# EAGLE design LED_Keychain_rev2 (EAGLE 9.6.2)
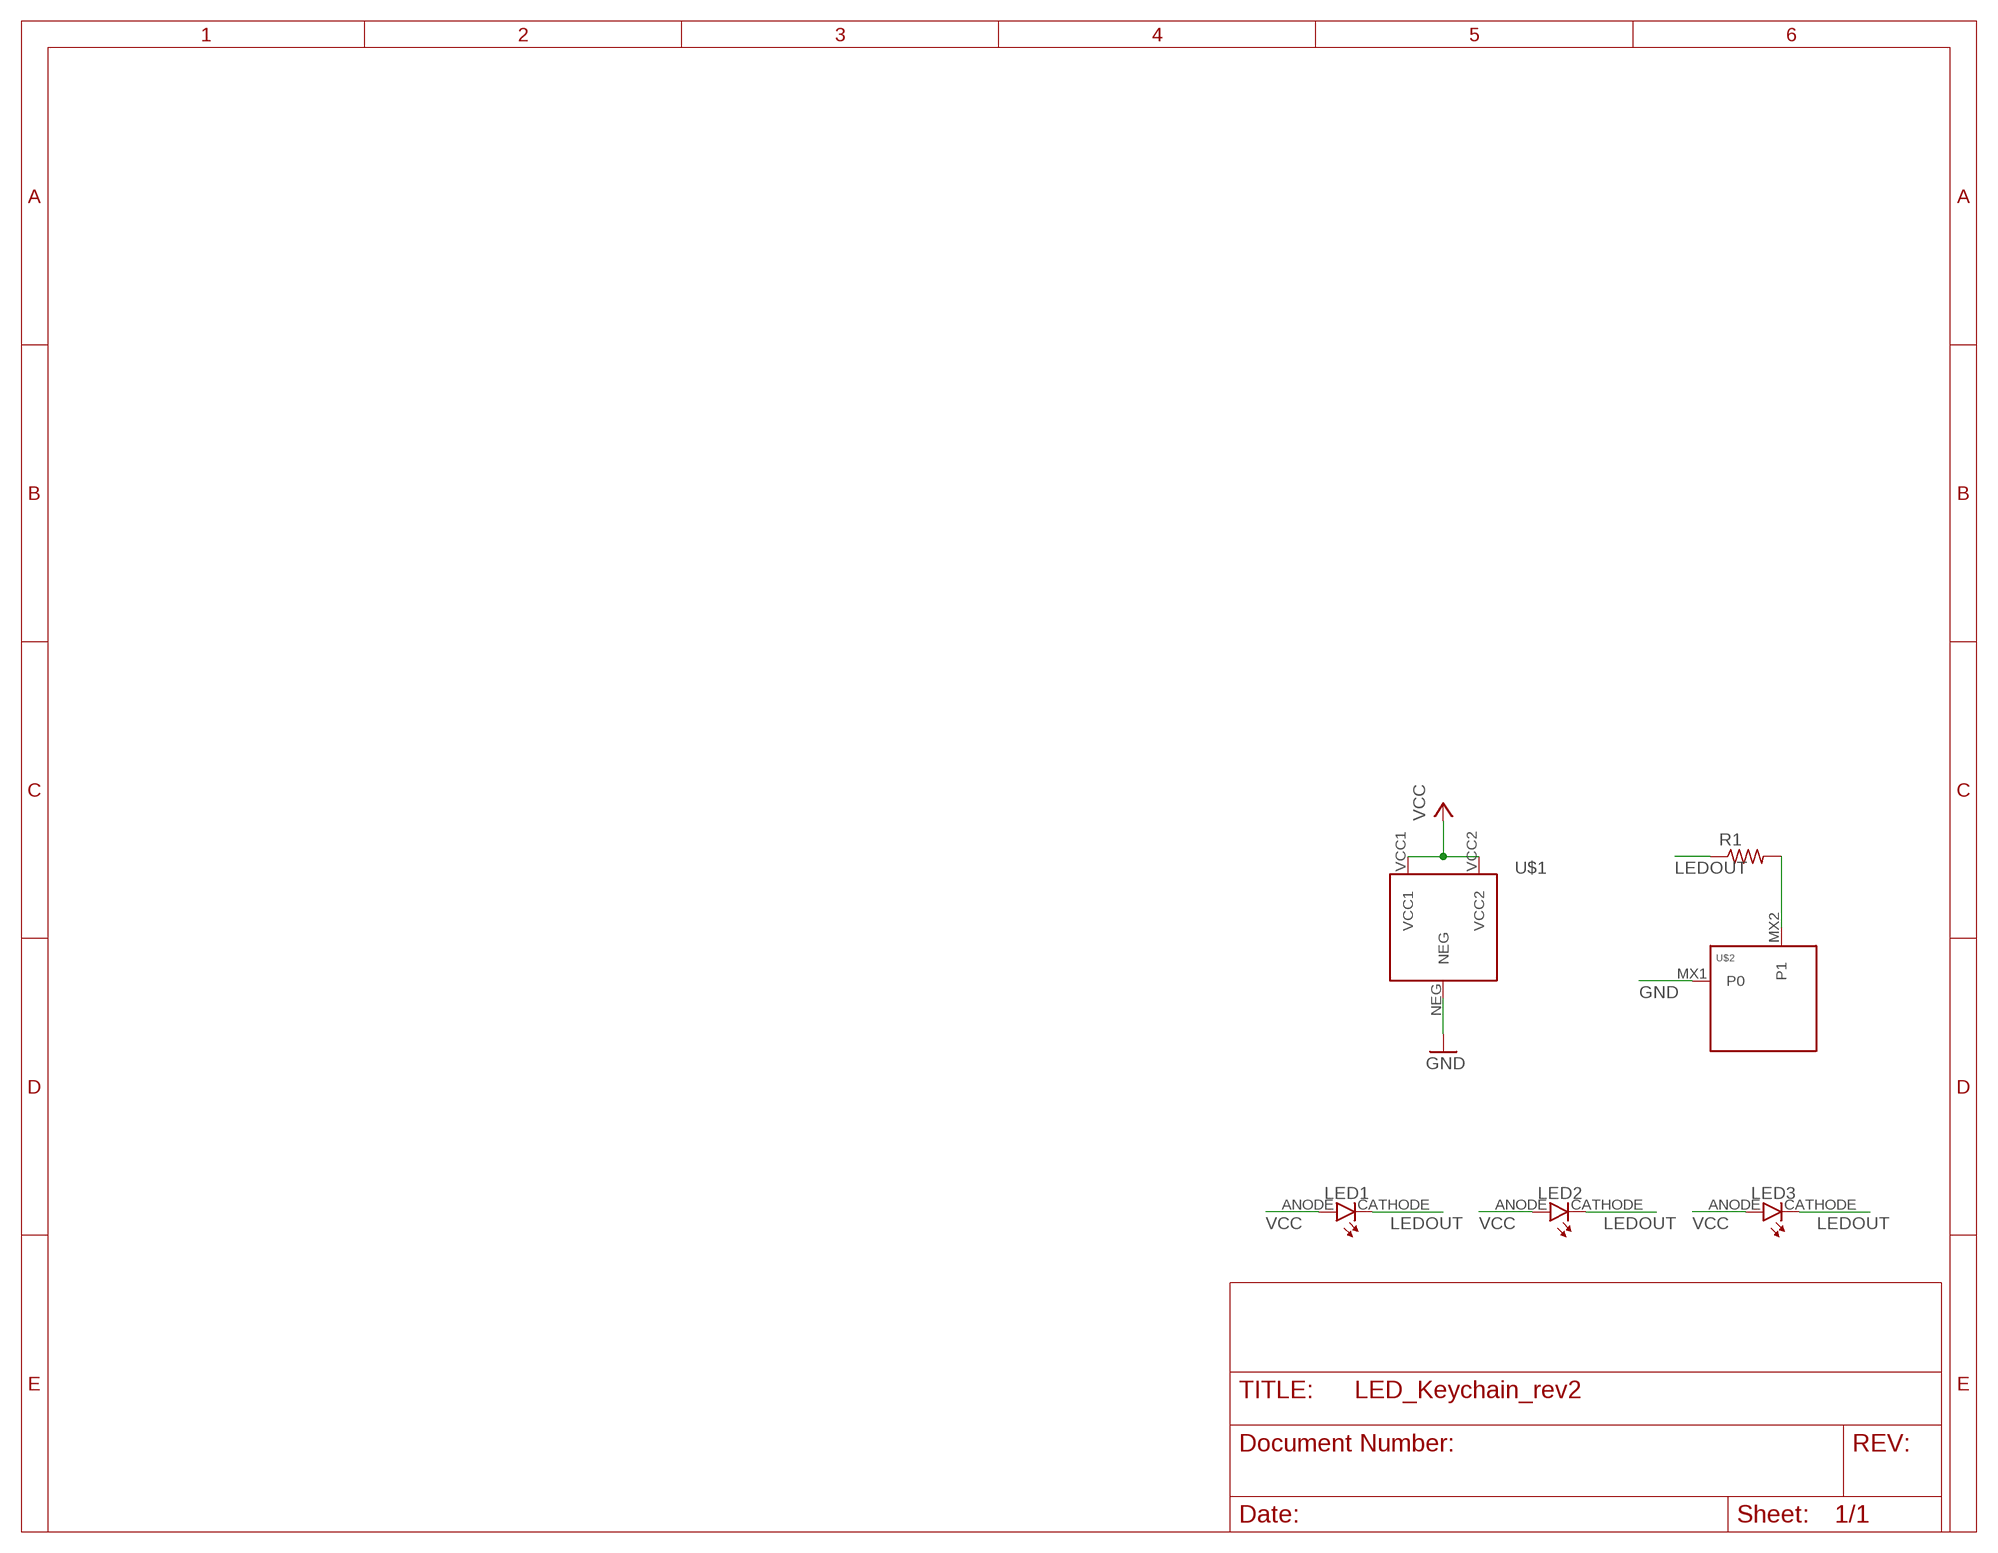
[diagram p0: schematic, sheet 1]

## Parts
LED1  KINGBRIGHT-A1608  [KINGBRIGHT-0603]
LED2  KINGBRIGHT-A1608  [KINGBRIGHT-0603]
LED3  KINGBRIGHT-A1608  [KINGBRIGHT-0603]
R1  R-US_R0603  [R0603]
U$1  KEYSTONE3035  [KEYSTONE3035]
U$2  KEYSWITCH-PLAIN-MX-1U  [MX-1U]

## Nets
GND: U$1.NEG U$2.MX1(P0)
LEDOUT: LED1.CATHODE LED2.CATHODE LED3.CATHODE R1.1
N$4: R1.2 U$2.MX2(P1)
VCC: LED1.ANODE LED2.ANODE LED3.ANODE U$1.VCC1 U$1.VCC2

## Library data of the parts
LED1-LED3 = LED_Keychain_lib:KINGBRIGHT-A1608
R1 = adafruit:R-US_: RESISTOR, American symbol
U$1 = LED_Keychain_lib:KEYSTONE3035
U$2 = Keyboard:KEYSWITCH-PLAIN

## Board
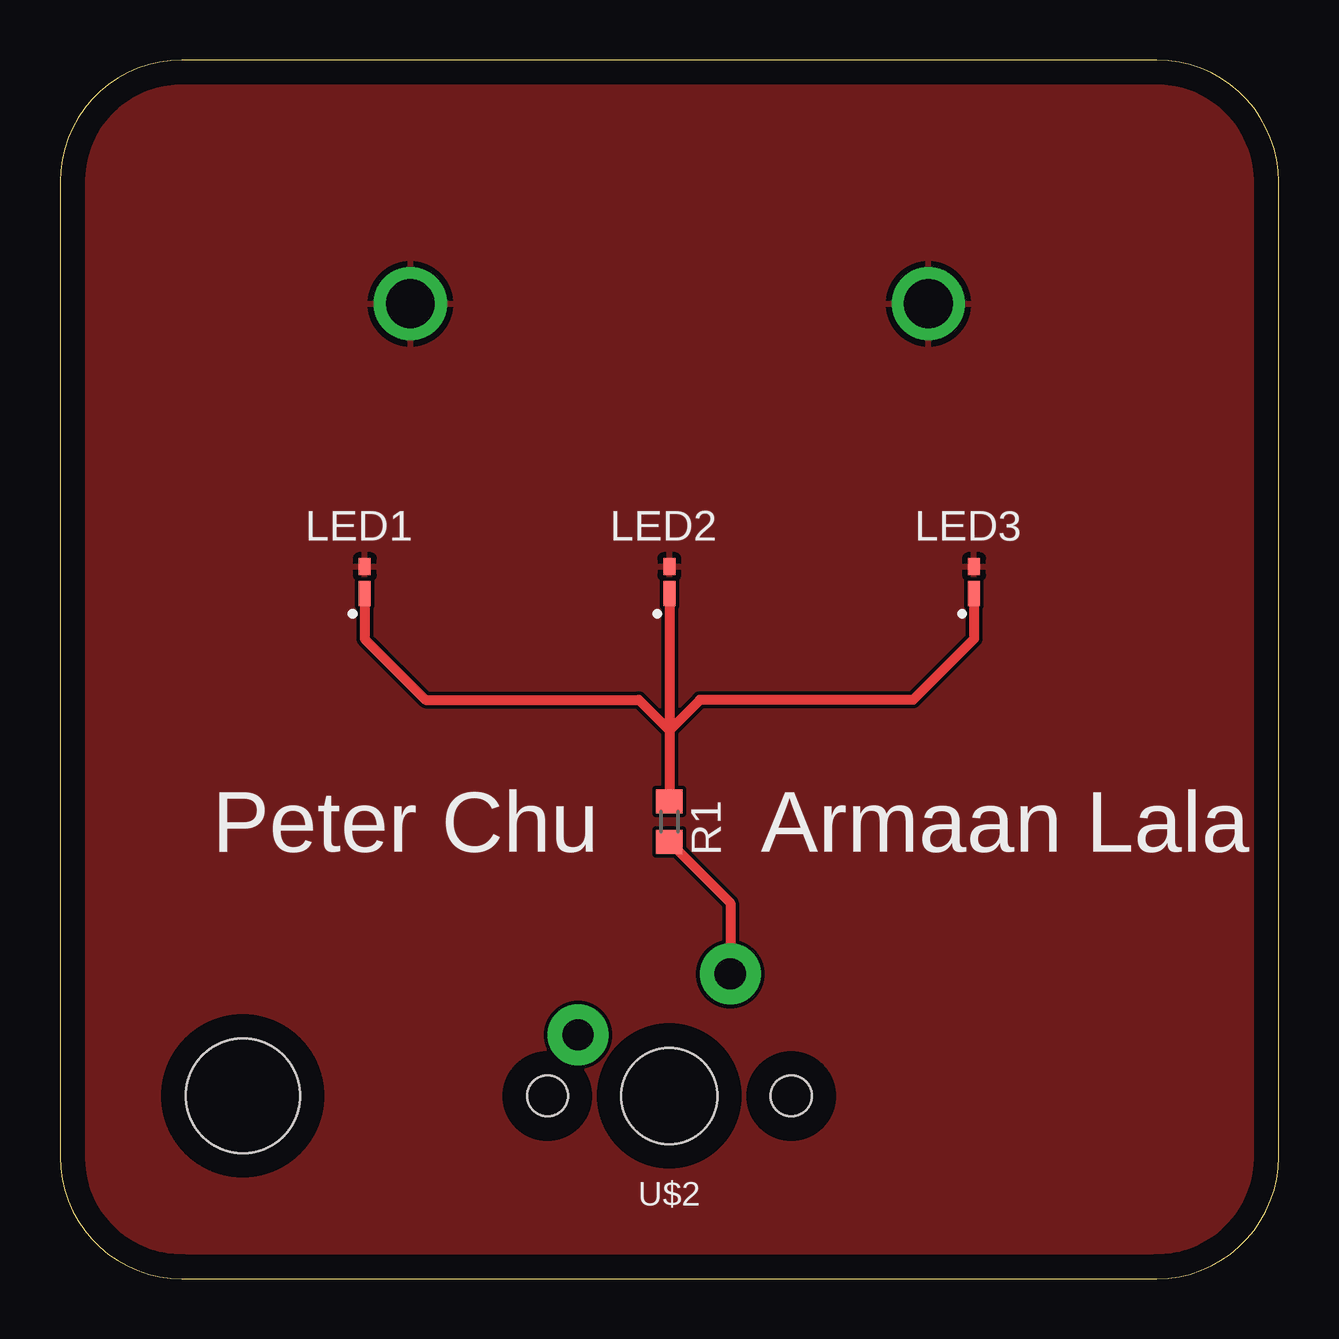
[diagram p1: board, top side]
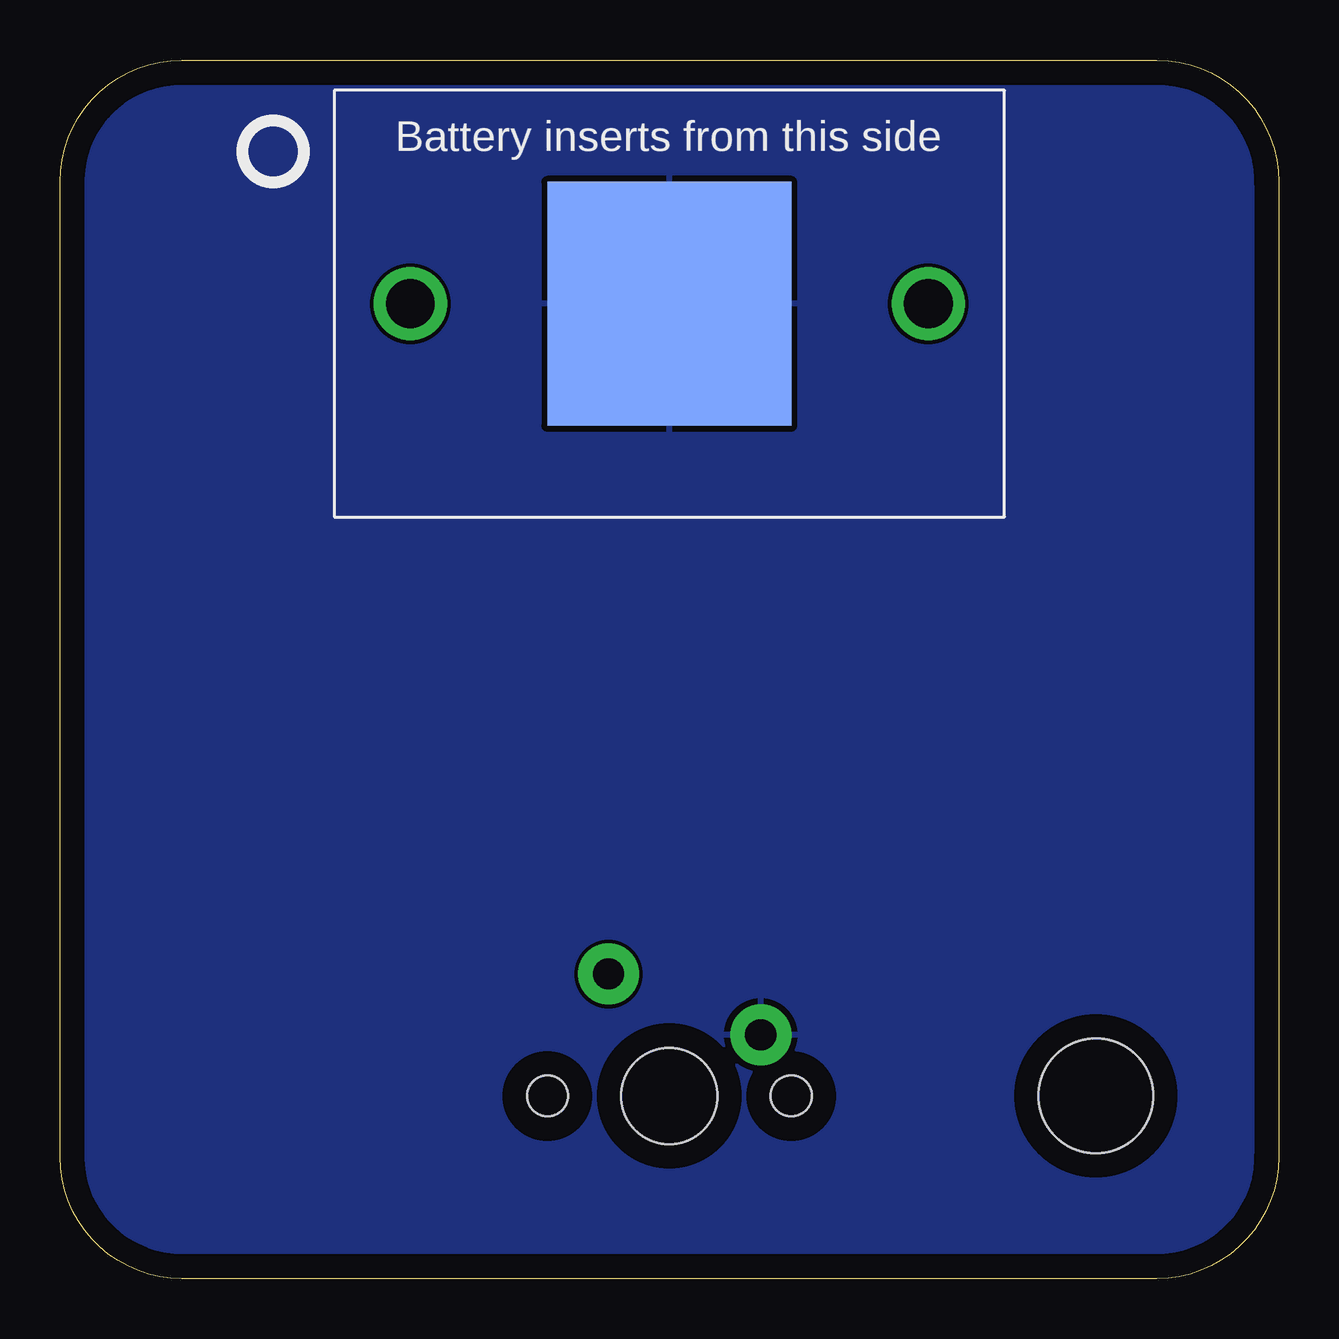
[diagram p2: board, bottom side, seen from below]

Size 50.8 x 50.8 mm. Coordinates in mm from the lower left corner, seen from the top.
Outline: 45.72,50.8 5.08,50.8 arc90 0,45.72 0,5.08 arc90 5.08,0 45.72,0 arc90 50.8,5.08 50.8,45.72 arc90 45.72,50.8
Copper layers (1*16): Top 0.035mm / dielectric 1.5mm / Bottom 0.035mm
Design rules "default": minimum track width 6mil, minimum drill 0.35mm, track to track 6mil, track to pad 6mil, pad to pad 6mil, via to via 6mil, smd to smd 6mil, copper to edge 40mil, drill to drill 6mil, minimum pad ring 10mil, minimum via ring 8mil, stop-mask expansion 4mil, vias tented up to drill 0mil, thermal gap 10mil
Holes 4.76 mm at 7.62,7.62

### Footprints (pad centres in the part's own frame; a part is rotated, then mirrored left to right if it is on the bottom)
KINGBRIGHT-0603 = smd 0.7 x 0.5: ANODE 0.47,0 | smd 1.05 x 0.5: CATHODE -0.645,0
R0603 = smd 1 x 1.1: 1 -0.85,0; 2 0.85,0
KEYSTONE3035 = smd 10.16 x 10.16: NEG 0,0 | drill 2.032: VCC1 -10.795,0; VCC2 10.795,0
MX-1U = drill 1.3 pad 2.54: MX1 -3.81,2.54; MX2 2.54,5.08 | hole 4: 0,0 | hole 1.7: -5.08,0; 5.08,0

### Placement (x,y rotation side)
LED1  12.7,29.21 90 top
LED2  25.4,29.21 90 top
LED3  38.1,29.21 90 top
R1  25.4,19.05 270 top
U$1  25.4,40.64 0 bottom
U$2  25.4,7.62 0 top

### Tracks (layer width: path | path; a pad name or v marks a point on that pad's centre or on a via)
GND
  pour Bottom: -5.08,52.07 -5.08,-3.81 -2.54,-6.35 57.15,-6.35 58.42,-5.08 58.42,59.69 2.54,59.69
LEDOUT
  Top 0.406: 25.4,22.86 24.13,24.13 15.24,24.13 12.7,26.67 LED1.CATHODE | 25.4,22.86 R1.1 | 25.4,22.86 26.67,24.13 35.56,24.13 38.1,26.67 LED3.CATHODE | LED2.CATHODE 25.4,22.86
N$4
  Top 0.406: R1.2 27.94,15.66 U$2.MX2
VCC
  pour Top: -21.59,48.26 -16.51,43.18 -16.51,-12.7 63.5,-12.7 72.39,-3.81 72.39,76.2 63.5,85.09 15.24,85.09

### Text on the board
tPlace: Peter Chu | Armaan Lala